# Altium schematic sheet JHZ-E01S-HW-Drive-HI-S0.1-面罩电机驱动器.SchDoc
size A3
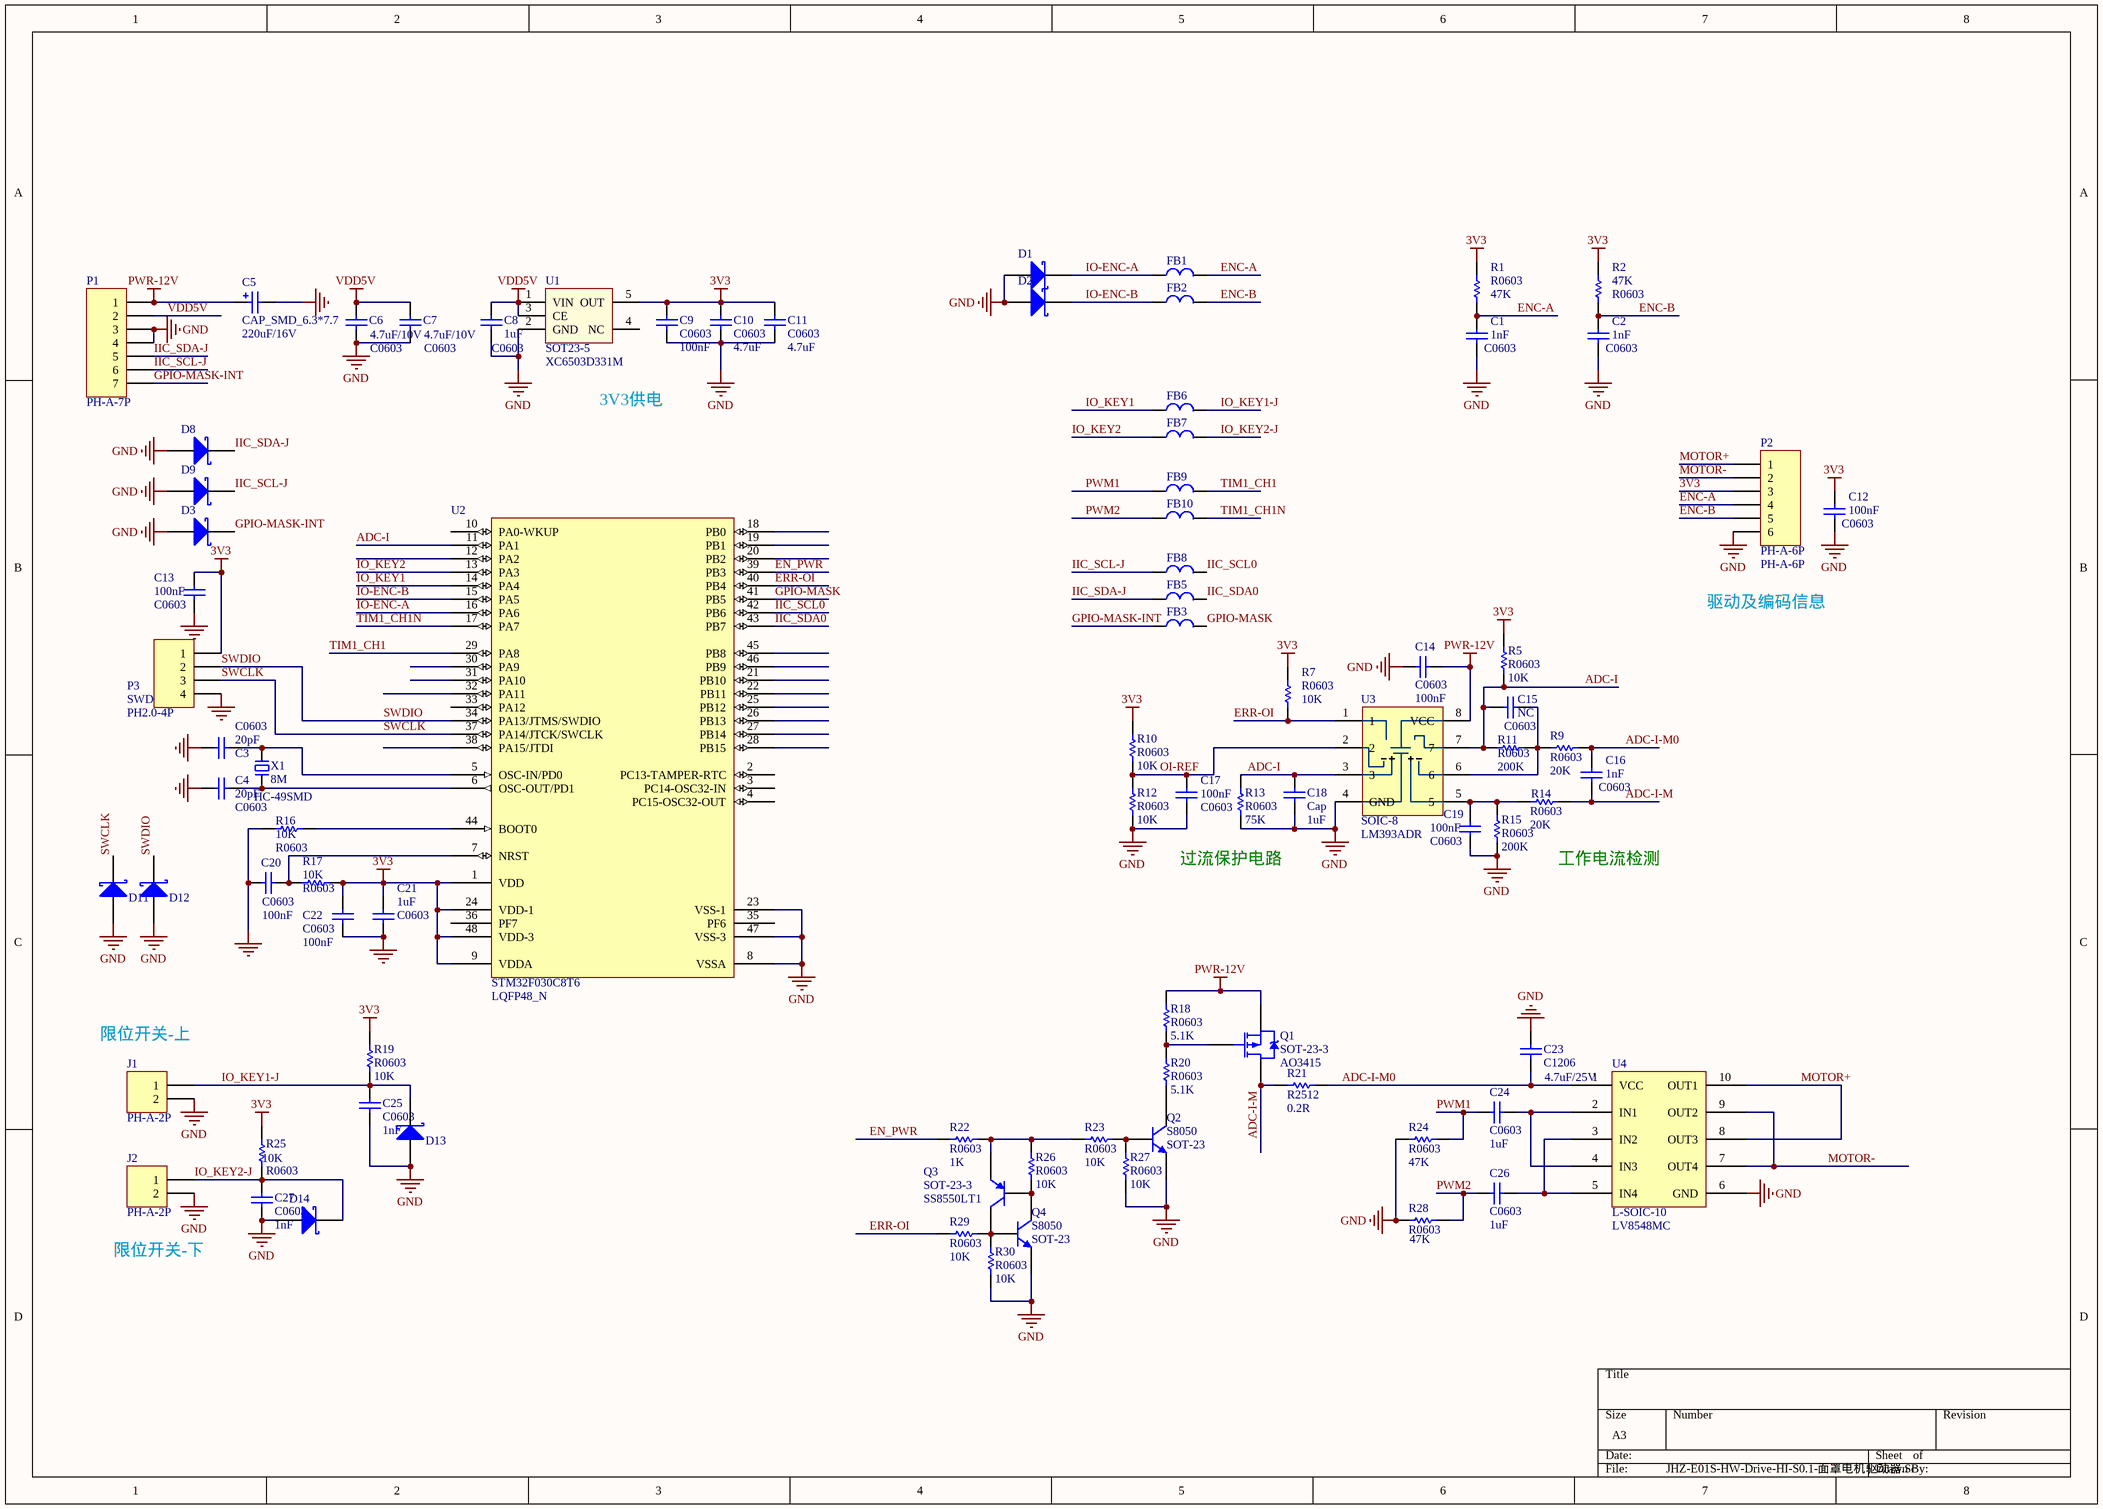
[diagram p0: JHZ-E01S-HW-Drive-HI-S0.1-面罩电机驱动器.SchDoc]

## Parts
C1  C0603  value 1nF  [C0603_M1608]
C2  C0603  value 1nF  [C0603_M1608]
C3  C0603  value 20pF  [C0603_M1608]
C4  C0603  value 20pF  [C0603_M1608]
C5  CAP_SMD_6.3*7.7  value 220uF/16V  [CAP_SMD_6.3*7.7]
C6  C0603  value 4.7uF/10V  [C0603_M1608]
C7  C0603  value 4.7uF/10V  [C0603_M1608]
C8  C0603  value 1uF  [C0603_M1608]
C9  C0603  value 100nF  [C0603_M1608]
C10  C0603  value 4.7uF  [C0603_M1608]
C11  C0603  value 4.7uF  [C0603_M1608]
C12  C0603  value 100nF  [C0603_M1608]
C13  C0603  value 100nF  [C0603_M1608]
C14  C0603  value 100nF  [C0603_M1608]
C15  C0603  value NC  [C0603_M1608]
C16  C0603  value 1nF  [C0603_M1608]
C17  C0603  value 100nF  [C0603_M1608]
C18  Cap  value 1uF  [C0603_M1608]
C19  C0603  value 100nF  [C0603_M1608]
C20  C0603  value 100nF  [C0603_M1608]
C21  C0603  value 1uF  [C0603_M1608]
C22  C0603  value 100nF  [C0603_M1608]
C23  C1206  value 4.7uF/25V  [C1206_M3216]
C24  C0603  value 1uF  [C0603_M1608]
C25  C0603  value 1nF  [C0603_M1608]
C26  C0603  value 1uF  [C0603_M1608]
C27  C0603  value 1nF  [C0603_M1608]
D1  SOD-523  [SOD-523]  (value not drawn)
D2  SOD-523  [SOD-523]  (value not drawn)
D3  SOD-523  [SOD-523]  (value not drawn)
D8  SOD-523  [SOD-523]  (value not drawn)
D9  SOD-523  [SOD-523]  (value not drawn)
D11  SOD-523  [SOD-523]  (value not drawn)
D12  SOD-523  [SOD-523]  (value not drawn)
D13  SOD-523  [SOD-523]  (value not drawn)
D14  SOD-523  [SOD-523]  (value not drawn)
FB1  FBM1608-0E0PT  [R0603_M1608]  (value not drawn)
FB2  FBM1608-0E0PT  [R0603_M1608]  (value not drawn)
FB3  FBM1608-0E0PT  [R0603_M1608]  (value not drawn)
FB5  FBM1608-0E0PT  [R0603_M1608]  (value not drawn)
FB6  FBM1608-0E0PT  [R0603_M1608]  (value not drawn)
FB7  FBM1608-0E0PT  [R0603_M1608]  (value not drawn)
FB8  FBM1608-0E0PT  [R0603_M1608]  (value not drawn)
FB9  FBM1608-0E0PT  [R0603_M1608]  (value not drawn)
FB10  FBM1608-0E0PT  [R0603_M1608]  (value not drawn)
J1  PH-A-2P  [PH-A-2P]
J2  PH-A-2P  [PH-A-2P]
P1  PH-A-7P  [PH-A-7P]
P2  PH-A-6P  [PH-A-6P]
P3  PH2.0-4P  value SWD  [PH-A-4P]
Q1  SOT-23-3  value AO3415  [SOT-23-3]
Q2  SOT-23  value S8050  [SOT-23_L]
Q3  SOT-23-3  value SS8550LT1  [SOT-23-3]
Q4  SOT-23  value S8050  [SOT-23_L]
R1  R0603  value 47K  [R0603_M1608]
R2  R0603  value 47K  [R0603_M1608]
R5  R0603  value 10K  [R0603_M1608]
R7  R0603  value 10K  [R0603_M1608]
R9  R0603  value 20K  [R0603_M1608]
R10  R0603  value 10K  [R0603_M1608]
R11  R0603  value 200K  [R0603_M1608]
R12  R0603  value 10K  [R0603_M1608]
R13  R0603  value 75K  [R0603_M1608]
R14  R0603  value 20K  [R0603_M1608]
R15  R0603  value 200K  [R0603_M1608]
R16  R0603  value 10K  [R0603_M1608]
R17  R0603  value 10K  [R0603_M1608]
R18  R0603  value 5.1K  [R0603_M1608]
R19  R0603  value 10K  [R0603_M1608]
R20  R0603  value 5.1K  [R0603_M1608]
R21  R2512  value 0.2R  [R2512_M6332]
R22  R0603  value 1K  [R0603_M1608]
R23  R0603  value 10K  [R0603_M1608]
R24  R0603  value 47K  [R0603_M1608]
R25  R0603  value 10K  [R0603_M1608]
R26  R0603  value 10K  [R0603_M1608]
R27  R0603  value 10K  [R0603_M1608]
R28  R0603  value 47K  [R0603_M1608]
R29  R0603  value 10K  [R0603_M1608]
R30  R0603  value 10K  [R0603_M1608]
U1  SOT23-5  value XC6503D331M  [SOT-23-5]
U2  LQFP48_N  value STM32F030C8T6  [LQFP48_N]
U3  SOIC-8  value LM393ADR  [SOIC-8]
U4  L-SOIC-10  value LV8548MC  [L-SOIC-10]
X1  8M  value HC-49SMD  [HC-49SMD]

## Nets
3V3: C9.1 C10.1 C11.1 C12.1 C13.1 C21.1 C22.1 P2.3 P3.1 R1.2 R2.2 R5.1 R7.2 R10.2 R17.2 R19.2 R25.2 U1.5(OUT) U2.1(VDD) U2.9(VDDA) U2.24(VDD-1) U2.48(VDD-3)
GND: C1.2 C2.2 C3.1 C4.1 C5.2 C6.1 C7.1 C8.1 C9.2 C10.2 C11.2 C12.2 C13.2 C14.2 C17.1 C18.1 C19.1 C20.1 C21.2 C22.2 C23.2 C25.1 C27.1 D1.1(A) D2.1(A) D3.1(A) D8.1(A) D9.1(A) D11.1(A) D12.1(A) D13.1(A) D14.1(A) J1.2 J2.2 P1.3 P1.4 P2.6 P3.4 Q2.2(E) Q4.2(E) R12.1 R13.1 R15.1 R16.1 R24.2 R27.1 R28.2 R30.1 U1.2(GND) U2.8(VSSA) U2.23(VSS-1) U2.47(VSS-3) U3.4(GND) U4.6(GND)
PWR-12V: C5.1 C14.1 P1.1 Q1.2(S) R18.2 U3.8(VCC)
VDD5V: C6.2 C7.2 C8.2 P1.2 U1.1(VIN) U1.3(CE)
ADC-I: C15.2 C18.2 R5.2 R11.1 R13.2 U2.11(PA1) U3.3 U3.7
ADC-I-M: C16.1 Q1.3(D) R14.1 R21.1
ADC-I-M0: C16.2 C23.1 R9.1 R21.2 U4.1(VCC)
EN_PWR: R22.2 U2.39(PB3)
ENC-A: C1.1 FB1.2 P2.4 R1.1
ENC-B: C2.1 FB2.2 P2.5 R2.1
ERR-OI: R7.1 R29.2 U2.40(PB4) U3.1
GPIO-MASK: FB3.2 U2.41(PB5)
GPIO-MASK-INT: D3.2(K) FB3.1 P1.7
IIC_SCL0: FB8.2 U2.42(PB6)
IIC_SCL-J: D9.2(K) FB8.1 P1.6
IIC_SDA0: FB5.2 U2.43(PB7)
IIC_SDA-J: D8.2(K) FB5.1 P1.5
IO-ENC-A: D1.2(K) FB1.1 U2.16(PA6)
IO-ENC-B: D2.2(K) FB2.1 U2.15(PA5)
IO_KEY1: FB6.1 U2.14(PA4)
IO_KEY1-J: C25.2 D13.2(K) FB6.2 J1.1 R19.1
IO_KEY2: FB7.1 U2.13(PA3)
IO_KEY2-J: C27.2 D14.2(K) FB7.2 J2.1 R25.1
MOTOR+: P2.1 U4.8(OUT3) U4.10(OUT1)
MOTOR-: P2.2 U4.7(OUT4) U4.9(OUT2)
OI-REF: C17.2 R10.1 R12.2 U3.2
PWM1: C24.1 FB9.1 R24.1
PWM2: C26.1 FB10.1 R28.1
SWCLK: D11.2(K) P3.3 U2.37(PA14/JTCK/SWCLK)
SWDIO: D12.2(K) P3.2 U2.34(PA13/JTMS/SWDIO)
TIM1_CH1: FB9.2 U2.29(PA8)
TIM1_CH1N: FB10.2 U2.17(PA7)
NetC3_2: C3.2 U2.5(OSC-IN/PD0) X1.2
NetC4_2: C4.2 U2.6(OSC-OUT/PD1) X1.1
NetC15_1: C15.1 R9.2 R11.2 U3.6
NetC19_2: C19.2 R14.2 R15.2 U3.5
NetC20_2: C20.2 R17.1 U2.7(NRST)
NetC24_2: C24.2 U4.2(IN1) U4.4(IN3)
NetC26_2: C26.2 U4.3(IN2) U4.5(IN4)
NetQ1_1: Q1.1(G) R18.1 R20.2
NetQ2_1: Q2.1(B) R23.1 R27.2
NetQ2_3: Q2.3(C) R20.1
NetQ3_1: Q3.1(B) Q4.3(C) R26.1
NetQ3_2: Q3.2(E) R22.1 R23.2 R26.2
NetQ3_3: Q3.3(C) Q4.1(B) R29.1 R30.2
NetR16_2: R16.2 U2.44(BOOT0)

Not connected (* = marked no-connect by the designer): U1 4(NC); U2 2(PC13-TAMPER-RTC) 3(PC14-OSC32-IN) 4(PC15-OSC32-OUT) 10(PA0-WKUP) 12(PA2) 18(PB0) 19(PB1) 20(PB2) 21(PB10) 22(PB11) 25(PB12) 26(PB13) 27(PB14) 28(PB15) 30(PA9) 31(PA10) 32(PA11) 33(PA12) 35(PF6) 36(PF7) 38(PA15/JTDI) 45(PB8) 46(PB9)

## Notes on the sheet
- 3V3供电
- 驱动及编码信息
- 过流保护电路
- 工作电流检测
- (near J1) 限位开关-上
- (near J2) 限位开关-下

## Library data of the parts
C1 C2 C12 C14-C17 C19 = MCC0603: Multilayer Ceramic Capacitor 0603
C3 C4 C6-C11 C13 C18 C20-C27 = Cap: Capacitor; Published: 8-Jun-2000; LatestRevisionDate: 17-Jul-2002; LatestRevisionNote: Re-released for DXP Platform.; PackageReference: RAD-0.3; Publisher: Altium Limited; PackageDescription: Radial Cap, Thru-Hole; 2 Leads; 0.3 in Pin Spacing
C5 = CAP_SMD_6.3*7.7: SMD Capacitor 6.3*7.7
D1-D3 D8 D9 D11-D14 = SK2B: 2.0A SURFACE MOUNT SCHOTTKY BARRIER  RECTIFIERS; Value: CESD5V0D5
FB1-FB3 FB5-FB10 = FBM1608-0E0PT: 磁珠Ferrite Bead; Value: FBM1608-0E0PT
J1 J2 = PH-A-2P: Header, 2.0mm,2-Pin; Value: PH-A-2P
P1 = PH-A-7P: Header, 2.0mm,7-Pin; Value: PH-A-7P
P2 = PH-A-6P: Header, 2.0mm,6-Pin; Value: PH-A-6P
P3 = Header 4: Header, 4-Pin; LatestRevisionDate: 17-Jul-2002; LatestRevisionNote: Re-released for DXP Platform.; Publisher: Altium Limited
Q1 = AO3415: P-Channel MOSFET
Q2 Q4 = NPN: NPN Bipolar Transistor; Published: 8-Jun-2000; LatestRevisionDate: 17-Jul-2002; LatestRevisionNote: Re-released for DXP Platform.; PackageReference: TO-226-AA; Publisher: Altium Limited; PackageDescription: TO, Flat Index; 3 In-Line, Axial Leads; Body Dia. 4.8mm; Leads 0.55 x 0.51 mm (max); Code_JEDEC: TO-226-AA
Q3 = SS8550LT1: PNP Bipolar Transistor
R1 R2 R7 R16-R30 = Res1: Resistor; Published: 8-Jun-2000; LatestRevisionDate: 17-Jul-2002; LatestRevisionNote: Re-released for DXP Platform.; PackageReference: AXIAL-0.3; Publisher: Altium Limited
  R1 R2 R16-R30: PackageDescription: Axial Device, Thru-Hole; 2 Leads; 0.3 in Pin Spacing
R5 R9-R15 = R0603_M1608: Resistor
U1 = XC6503D301MR
U2 = STM32F103C8T6: STM32 ARM-based 32-bit MCU with 64 Kbytes Flash, 48-pin LQFP, Industrial Temperature; Published: *; DatasheetVersion: *; PackageVersion: *; PackageReference: *; Publisher: *; PackageDescription: *; ComponentLink1Description: *; ComponentLink1URL: *; ComponentLink2Description: *; ComponentLink2URL: *
U3 = LM358ADR: Dual Operational Amplifiers
U4 = LV8548MC
X1 = XTAL